# Altium schematic sheet 最小系统.SchDoc
size A4
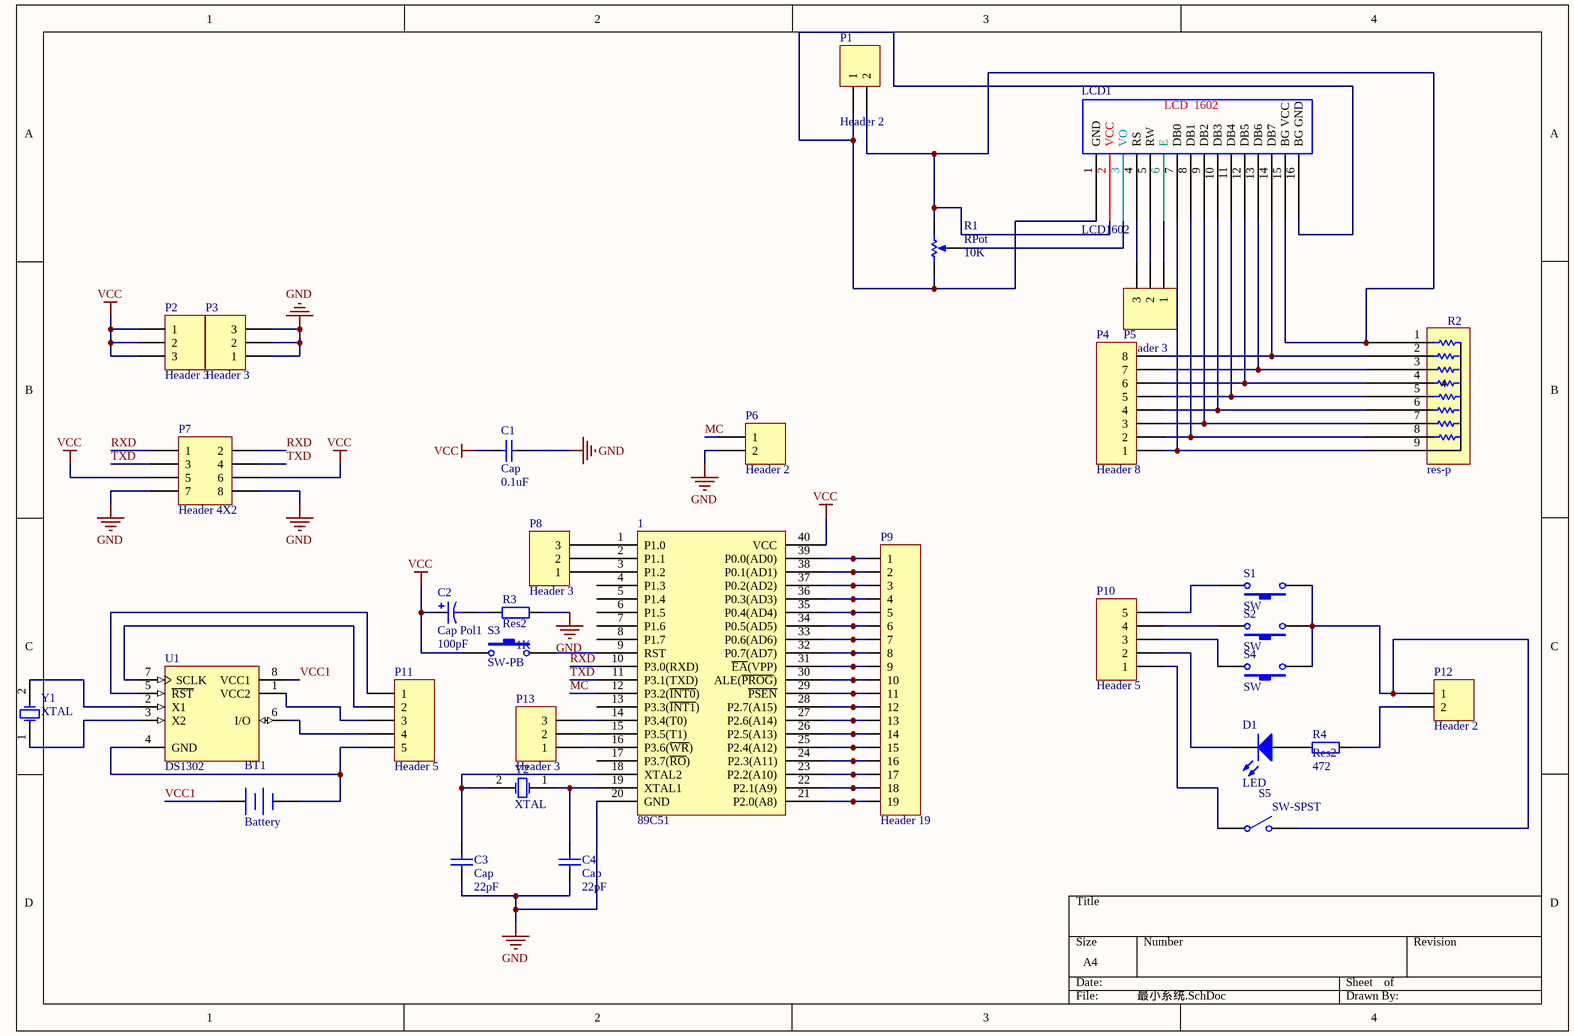
[diagram p0: 最小系统.SchDoc]

## Parts
1  89C51
BT1  Battery  [BAT-2]
C1  Cap  value 0.1uF  [RAD-0.3]
C2  Cap Pol1  value 100pF  [CAPPR1.27-1.7x2.8]
C3  Cap  value 22pF  [CAPR2.54-5.1x3.2]
C4  Cap  value 22pF  [CAPR2.54-5.1x3.2]
D1  LED  [LED-1]
LCD1  LCD1602  [1602LCD]
P1  Header 2  [HDR1X2]
P2  Header 3  [HDR1X3]
P3  Header 3  [HDR1X3]
P4  Header 8  [HDR1X8]
P5  Header 3  [HDR1X3]
P6  Header 2  [HDR1X2]
P7  Header 4X2  [HDR2X4]
P8  Header 3  [HDR1X3]
P9  Header 19  [HDR1X19]
P10  Header 5  [HDR1X5]
P11  Header 5  [HDR1X5]
P12  Header 2  [HDR1X2]
P13  Header 3  [HDR1X3]
R1  RPot  value 10K  [VR5]
R2  res-p  [HDR1X9]
R3  Res2  value 1K  [AXIAL-0.4]
R4  Res2  value 472  [AXIAL-0.4]
S1  SW  [SW/PB-V4/H7.1]
S2  SW  [SW/PB-V4/H7.1]
S3  SW-PB  [SW/PB-V4/H7.1]
S4  SW  [SW/PB-V4/H7.1]
S5  SW-SPST  [SPST-2]
U1  DS1302  [DIP8]
Y1  XTAL  [BCY-W2/D3.1]
Y2  XTAL  [BCY-W2/D3.1]

## Nets
GND: 1.20(GND) C1.2 C3.2 C4.2 P3.1 P3.2 P3.3 P6.2 P7.7 P7.8 R3.2
VCC: 1.40(VCC) C1.1 C2.1 P2.1 P2.2 P2.3 P7.5 P7.6 S3.1
MC: 1.12(P3.2(~{INT0})) P6.1
RXD: 1.10(P3.0(RXD)) P7.1 P7.2
TXD: 1.11(P3.1(TXD)) P7.3 P7.4
VCC1: BT1.1(+) U1.8(VCC1)
Net1_1: 1.1(P1.0) P8.3
Net1_2: 1.2(P1.1) P8.2
Net1_3: 1.3(P1.2) P8.1
Net1_9: 1.9(RST) S3.2
Net1_14: 1.14(P3.4(T0)) P13.3
Net1_15: 1.15(P3.5(T1)) P13.2
Net1_16: 1.16(P3.6(~{WR})) P13.1
Net1_18: 1.18(XTAL2) C3.1 Y2.2(OSC2)
Net1_19: 1.19(XTAL1) C4.1 Y2.1(OSC1)
Net1_21: 1.21(P2.0(A8)) P9.19
Net1_22: 1.22(P2.1(A9)) P9.18
Net1_23: 1.23(P2.2(A10)) P9.17
Net1_24: 1.24(P2.3(A11)) P9.16
Net1_25: 1.25(P2.4(A12)) P9.15
Net1_26: 1.26(P2.5(A13)) P9.14
Net1_27: 1.27(P2.6(A14)) P9.13
Net1_28: 1.28(P2.7(A15)) P9.12
Net1_29: 1.29(~{PSEN}) P9.11
Net1_30: 1.30(ALE(~{PROG})) P9.10
Net1_31: 1.31(~{EA}(VPP)) P9.9
Net1_32: 1.32(P0.7(AD7)) P9.8
Net1_33: 1.33(P0.6(AD6)) P9.7
Net1_34: 1.34(P0.5(AD5)) P9.6
Net1_35: 1.35(P0.4(AD4)) P9.5
Net1_36: 1.36(P0.3(AD3)) P9.4
Net1_37: 1.37(P0.2(AD2)) P9.3
Net1_38: 1.38(P0.1(AD1)) P9.2
Net1_39: 1.39(P0.0(AD0)) P9.1
NetBT1_2: BT1.2(-) P11.5 U1.4(GND)
NetC2_2: C2.2 R3.1
NetD1_1: D1.1(A) R4.1
NetD1_2: D1.2(K) P10.2
NetLCD1_1: LCD1.1(GND) LCD1.16(BG_GND) P1.1 R1.1(TOP)
NetLCD1_2: LCD1.2(VCC) LCD1.15(BG_VCC) P1.2 R1.2(BOT) R2.1
NetLCD1_3: LCD1.3(VO) R1.3(TAP)
NetLCD1_4: LCD1.4(RS) P5.3
NetLCD1_5: LCD1.5(RW) P5.2
NetLCD1_6: LCD1.6(E) P5.1
NetLCD1_7: LCD1.7(DB0) P4.1 R2.9
NetLCD1_8: LCD1.8(DB1) P4.2 R2.8
NetLCD1_9: LCD1.9(DB2) P4.3 R2.7
NetLCD1_10: LCD1.10(DB3) P4.4 R2.6
NetLCD1_11: LCD1.11(DB4) P4.5 R2.5
NetLCD1_12: LCD1.12(DB5) P4.6 R2.4
NetLCD1_13: LCD1.13(DB6) P4.7 R2.3
NetLCD1_14: LCD1.14(DB7) P4.8 R2.2
NetP10_1: P10.1 S5.1(COMMON)
NetP10_3: P10.3 S4.2
NetP10_4: P10.4 S2.2
NetP10_5: P10.5 S1.2
NetP11_1: P11.1 U1.5(~{RST})
NetP11_2: P11.2 U1.7(SCLK)
NetP11_3: P11.3 U1.1(VCC2)
NetP11_4: P11.4 U1.6(I/O)
NetP12_1: P12.1 S1.1 S2.1 S4.1 S5.2(NO)
NetP12_2: P12.2 R4.2
NetU1_2: U1.2(X1) Y1.2(OSC2)
NetU1_3: U1.3(X2) Y1.1(OSC1)

Not connected (* = marked no-connect by the designer): 1 4(P1.3) 5(P1.4) 6(P1.5) 7(P1.6) 8(P1.7) 13(P3.3(~{INT1})) 17(P3.7(~{RO}))

## Notes on the sheet
- (in symbol LCD1602) LCD  1602

## Library data of the parts
1 = 8
BT1 = Battery: Multicell Battery; Published: 24-Mar-1999; LatestRevisionDate: 17-Jul-2002; LatestRevisionNote: Re-released for DXP Platform.; Publisher: Altium Limited
C1 C3 C4 = Cap: Capacitor; Published: 8-Jun-2000; LatestRevisionDate: 17-Jul-2002; LatestRevisionNote: Re-released for DXP Platform.; Publisher: Altium Limited
  C3 C4: PackageReference: RAD-0.3
C2 = Cap Pol1: Polarized Capacitor (Radial); Published: 8-Jun-2000; LatestRevisionDate: 17-Jul-2002; LatestRevisionNote: Re-released for DXP Platform.; Publisher: Altium Limited
P1 P6 P12 = Header 2: Header, 2-Pin; LatestRevisionDate: 17-Jul-2002; LatestRevisionNote: Re-released for DXP Platform.; Publisher: Altium Limited
P2 P3 P5 P8 P13 = Header 3: Header, 3-Pin; LatestRevisionDate: 17-Jul-2002; LatestRevisionNote: Re-released for DXP Platform.; Publisher: Altium Limited
P4 = Header 8: Header, 8-Pin; LatestRevisionDate: 17-Jul-2002; LatestRevisionNote: Re-released for DXP Platform.; Publisher: Altium Limited
P7 = Header 4X2: Header, 4-Pin, Dual row; LatestRevisionDate: 17-Jul-2002; LatestRevisionNote: Re-released for DXP Platform.; Publisher: Altium Limited
P9 = Header 19: Header, 19-Pin; LatestRevisionDate: 17-Jul-2002; LatestRevisionNote: Re-released for DXP Platform.; Publisher: Altium Limited
P10 P11 = Header 5: Header, 5-Pin; LatestRevisionDate: 17-Jul-2002; LatestRevisionNote: Re-released for DXP Platform.; Publisher: Altium Limited
R1 = RPot: Potentiometer; Sim Note: Enter the Resistance value and the set point into parameter fields.; Set Position: 0.5; Published: 8-Jun-2000; LatestRevisionDate: 17-Jul-2002; LatestRevisionNote: Re-released for DXP Platform.; Publisher: Altium Limited
R3 R4 = Res2: Resistor; Published: 8-Jun-2000; LatestRevisionDate: 17-Jul-2002; LatestRevisionNote: Re-released for DXP Platform.; Publisher: Altium Limited
S1 S2 S4 = SWITCH
S3 = SW-PB: Switch; Published: 24-Mar-1999; LatestRevisionDate: 17-Jul-2002; LatestRevisionNote: Re-released for DXP Platform.; Publisher: Altium Limited
S5 = SW-SPST: Single-Pole, Single-Throw Switch; Published: 24-Mar-1999; LatestRevisionDate: 17-Jul-2002; LatestRevisionNote: Re-released for DXP Platform.; PackageReference: SPST-2; Publisher: Altium Limited
U1 = DS1302: Trickle Charge Timekeeping Chip; Published: 13-Oct-2000; LatestRevisionDate: 06-Jun-2005; LatestRevisionNote: Stylized 3D Model Added.; DatasheetVersion: 2-Jul-1999; PackageVersion: 1999; PackageReference: DIP8; Publisher: Altium Limited; PackageDescription: DIP; 8 Leads; Row Spacing 7.62 mm; Pitch 2.54 mm; ComponentLink1Description: Manufacturer Link; ComponentLink1URL: http://www.maxim-ic.com/; ComponentLink2Description: Datasheet; ComponentLink2URL: http://pdfserv.maxim-ic.com/en/ds/DS1302.pdf
Y1 Y2 = XTAL: Crystal Oscillator; Published: 8-Jun-2000; LatestRevisionDate: 17-Jul-2002; LatestRevisionNote: Re-released for DXP Platform.; PackageReference: R38; Publisher: Altium Limited